# EAGLE design LoraCHIP (EAGLE 7.7.0)
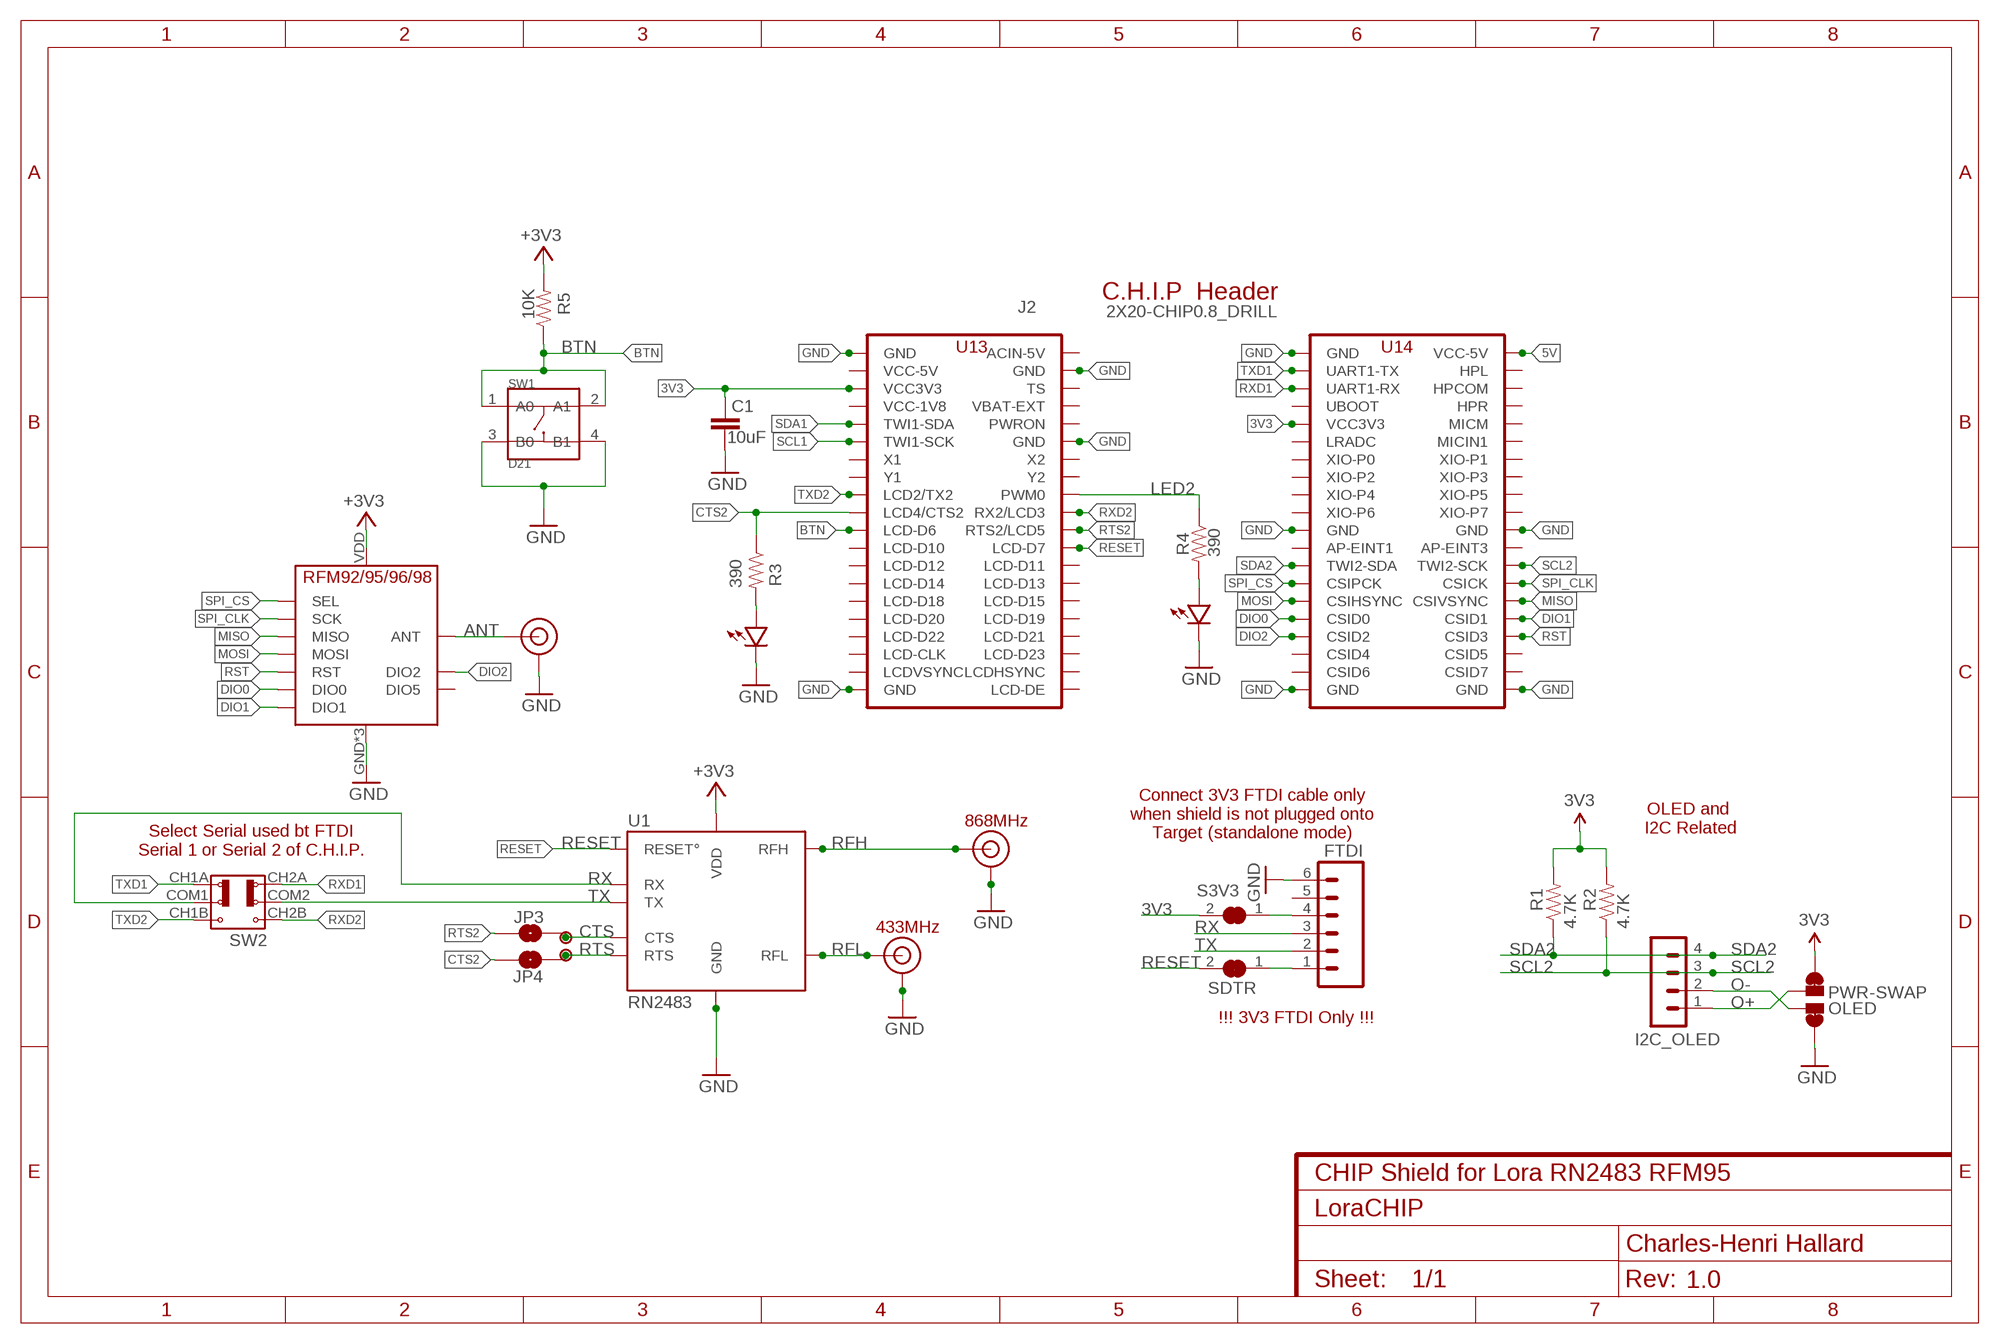
[diagram p0: schematic, sheet 1]
NAME (FRAME-A4L): CNAME: CHIP Shield for Lora RN2483 RFM95; CREVISION: 1.0; DESIGNER: Charles-Henri Hallard

## Parts
C1  10uF  CAP0805-CAP-LARGEPADS  [0805-CAP-LARGEPADS]
FTDI  M06SIP  [1X06]
I2C_OLED  CON_HEADER_1X04'SMALL''  [M1X4]
J2  2X20-CHIP0.8_DRILL  [2X20CHIP_NOOFFSET-TH_0.8]
J$1  ANTENNATINY  [SMA_UFL_PAD_TINY]
J$2  ANTENNATINY  [SMA_UFL_PAD_TINY]
J$3  ANTENNATINY  [SMA_UFL_PAD_TINY]
JP3  CTS  JUMPER-PAD-2-NOYES_SILK  [PAD-JUMPER-2-NO_YES_SILK]
JP4  RTS  JUMPER-PAD-2-NOYES_SILK  [PAD-JUMPER-2-NO_YES_SILK]
OLED  PWR-SWAP  PAD-JUMPER-SWAPSWAP  [PAD-JUMPER-SWAP]
P1  PADSMALL  [PAD-SMALL]
P2  PADSMALL  [PAD-SMALL]
R1  4.7K  RESISTOR0805-RES  [0805-RES]
R2  4.7K  RESISTOR0805-RES  [0805-RES]
R3  390  RESISTOR0805-RES  [0805-RES]
R4  390  RESISTOR0805-RES  [0805-RES]
R5  10K  RESISTOR0805-RES  [0805-RES]
S3V3  SOLDERJUMPER_CLOSED  [SOLDERJUMPER_CLOSEDWIRE]
SDTR  SOLDERJUMPER_CLOSED  [SOLDERJUMPER_CLOSEDWIRE]
SW1  D21  SMD-BUTTON-TOP-DHT-4235A(4P-4.2X3.2MM)  [SW4-SMD-4.2X3.2X2.5MM]
SW2  SWITCH-2CH-6P-3010010P1  [6P-2CH-2.54-9.1X3.5X3.2+2H]
U1  RN2483  RN2483_NOGPIOCTS  [RN2483_NOGPIO]
U$1  GRN  LED0805  [0805-LED]
U$3  RED  LED0805  [0805-LED]
U$4  RFM95  [RFM95]

## Nets
3V3: C1.2 J2.VCC3V3 J2.VCC3V3@1(VCC3V3) OLED.4 OLED.44 R1.2 R2.2 R5.2 S3V3.2 U1.VDD U1.VDD2(VDD) U$4.VDD(VCC) ; supply symbol labelled +3V3
5V: J2.VCC5V@1(VCC-5V)
ANT: J$3.ANT0(ANT) J$3.ANT1(ANT) J$3.ANT2(ANT) U$4.ANT
BTN: J2.LCD-D6 R5.1 SW1.1(A0) SW1.2(A1)
CTS: JP3.1 P1.1 U1.UART_CTS(CTS)
CTS2: J2.LCD-D4(LCD4/CTS2) JP4.2 R3.1
DIO0: J2.CSID0 U$4.DIO0
DIO1: J2.CSID1 U$4.DIO1
DIO2: J2.CSID2 U$4.DIO2
GND: C1.1 FTDI.6 J2.GND@1(GND) J2.GND@2(GND) J2.GND@3(GND) J2.GND@4(GND) J2.GND@5(GND) J2.GND@6(GND) J2.GND@7(GND) J2.GND@8(GND) J2.GND@10(GND) J$1.GND1(GND) J$1.GND2(GND) J$1.GND3(GND) J$1.GND4(GND) J$1.GND5(GND) J$1.GND6(GND) J$2.GND1(GND) J$2.GND2(GND) J$2.GND3(GND) J$2.GND4(GND) J$2.GND5(GND) J$2.GND6(GND) J$3.GND1(GND) J$3.GND2(GND) J$3.GND3(GND) J$3.GND4(GND) J$3.GND5(GND) J$3.GND6(GND) OLED.1 OLED.11 SW1.3(B0) SW1.4(B1) U1.GND U1.GND1(GND) U1.GND2(GND) U1.GND3(GND) U1.GND4(GND) U1.GND5(GND) U1.GND6(GND) U1.GND7(GND) U1.GND8(GND) U1.GND9(GND) U1.GND10(GND) U1.GND11(GND) U1.GND12(GND) U$1.MINUS U$3.MINUS
LD2: R4.2 U$1.PLUS
LED2: J2.PWM0 R4.1
MISO: J2.CSIVSYNC U$4.MISO
MOSI: J2.CSIHSYNC U$4.MOSI
N$1: FTDI.1 SDTR.1
N$2: FTDI.4 S3V3.1
N$3: R3.2 U$3.PLUS
O+: I2C_OLED.1 OLED.3
O-: I2C_OLED.2 OLED.2
RESET: J2.LCD-D7 SDTR.2 U1.RESET°
RFH: J$2.ANT0(ANT) J$2.ANT1(ANT) J$2.ANT2(ANT) U1.RFH
RFL: J$1.ANT0(ANT) J$1.ANT1(ANT) J$1.ANT2(ANT) U1.RFL
RST: J2.CSID3 U$4.RST
RTS: JP4.1 P2.1 U1.UART_RTS(RTS)
RTS2: J2.LCD-D5(RTS2/LCD5) JP3.2
RX: FTDI.3 SW2.COM1 U1.UART_RX(RX)
RXD1: J2.UART1-RX SW2.CH2A
RXD2: J2.LCD-D3(RX2/LCD3) SW2.CH2B
SCL1: J2.TWI1-SCK
SCL2: I2C_OLED.3 J2.TWI2-SCK R2.1
SDA1: J2.TWI1-SDA
SDA2: I2C_OLED.4 J2.TWI2-SDA R1.1
SPI_CLK: J2.CSICK U$4.SCK
SPI_CS: J2.CSIPCK U$4.NSS(SEL)
TX: FTDI.2 SW2.COM2 U1.UART_TX(TX)
TXD1: J2.UART1-TX SW2.CH1A
TXD2: J2.LCD-D2(LCD2/TX2) SW2.CH1B
Unconnected: FTDI.5 J2.AP-EINT1 J2.AP-EINT3 J2.BAT(VBAT-EXT) J2.CHG-IN(ACIN-5V) J2.CSID4 J2.CSID5 J2.CSID6 J2.CSID7 J2.FEL(UBOOT) J2.HPCOM J2.HPL J2.HPR J2.LCD-CLK J2.LCD-D10 J2.LCD-D11 J2.LCD-D12 J2.LCD-D13 J2.LCD-D14 J2.LCD-D15 J2.LCD-D18 J2.LCD-D19 J2.LCD-D20 J2.LCD-D21 J2.LCD-D22 J2.LCD-D23 J2.LCD-DE J2.LCD-HSYNC(LCDHSYNC) J2.LCD-VSYNC(LCDVSYNC) J2.LRADC J2.MICIN1 J2.MICM J2.PWRON J2.TS J2.X1 J2.X2 J2.XIO-P0 J2.XIO-P1 J2.XIO-P2 J2.XIO-P3 J2.XIO-P4 J2.XIO-P5 J2.XIO-P6 J2.XIO-P7 J2.Y1 J2.Y2 U$4.DIO5

## Notes on the sheet
- C.H.I.P  Header
- Connect 3V3 FTDI cable only
  when shield is not plugged onto
  Target (standalone mode)
- OLED and 
  I2C Related
- 868MHz
- Select Serial used bt FTDI
  Serial 1 or Serial 2 of C.H.I.P.
- 433MHz
- !!! 3V3 FTDI Only !!!

## Power pins joined to a net without a drawn wire
GND: U$4.GND U$4.GND1(GND) U$4.GND2(GND)
VCC-1V8: J2.VCC1V8(VCC-1V8)
VCC-5V: J2.VCC5V@0(VCC-5V)

## Library data of the parts
C1 = _c2h:CAP: Capacitor Standard 0603 ceramic capacitor, and 0.1" leaded capacitor.
FTDI = JeeLabs.rpt:M06: Header 6 Standard 6-pin 0.1" header. Use with straight break away headers (SKU : PRT-00116), right angle break away headers (PRT-00553), swiss pins (PRT-00743), machine pins (PRT-00117), and female headers (PRT-00115). Molex polarized connector foot print use with SKU : PRT-08094 with associated crimp pins and housings. NOTES ON THE VARIANTS LOCK and LOCK_LONGPADS... This footprint was designed to help hold the alignment of a through-hole component (i.e. 6-pin header) while soldering it into place. You may notice that each hole has been shifted either up or down by 0.005 of an inch from it's more standard position (which is a perfectly straight line). This slight alteration caused the pins (the squares in the middle) to touch the edges of the holes. Because they are alternating, it causes a "brace" to hold the component in place. 0.005 has proven to be the perfect amount of "off-center" position when using our standard breakaway headers. Although looks a little odd when you look at the bare footprint, once you have a header in there, the alteration is very hard to notice. Also, if you push a header all the way into place, it is covered up entirely on the bottom side. This idea of altering the position of holes to aid alignment will be further integrated into the Sparkfun Library for other footprints. It can help hold any component with 3 or more connection pins.
I2C_OLED = _c2h:CON_HEADER_1X04
J2 = CHIP:2X20-CHIP: Chip header; DESC: 0.8mm drill, no offset
J$1-J$3 = _c2h:ANTENNA: SMA Antenna Connector End launch SMA connector. The paste layer has been removed so that the connector can be hand soldered onto the board after reflow.
JP3 JP4 = SparkFun-Passives:JUMPER-PAD-2-NO
OLED = _c2h:PAD-JUMPER-SWAP
P1 P2 = _c2h-MacBook Pro de Charles-Henri:PAD
R1-R5 = _c2h:RESISTOR: Resistor Basic schematic elements and footprints for 0603, 1206, and PTH resistors.
S3V3 SDTR = microbuilder:SOLDERJUMPER_CLOSED: Solder Jumper - Closed These solder jumpers are closed by default CLOSEDWIRE - 10 mil trace between pads that can be cut and resoldered later CLOSEDPERM - 63 mil trace between pads for a permanent connection (used to 'bridge' two signals, a shameless hack for Eagle). Can double as a test point as well (no cream layer)
SW1 = Switch-2016:SMD-BUTTON-TOP-DHT-4235A(4P-4.2X3.2MM): 311020045; MPN: DHT-4235A; VALUE: DHT-4235A
SW2 = seeed-OPL:SWITCH-2CH-6P*: MS-22D18 G2 ROHS
U1 = _c2h-MacBook Pro de Charles-Henri:RN2483_NOGPIO
U$1 U$3 = _c2h:LED
U$4 = _c2h:RFM95

## Board
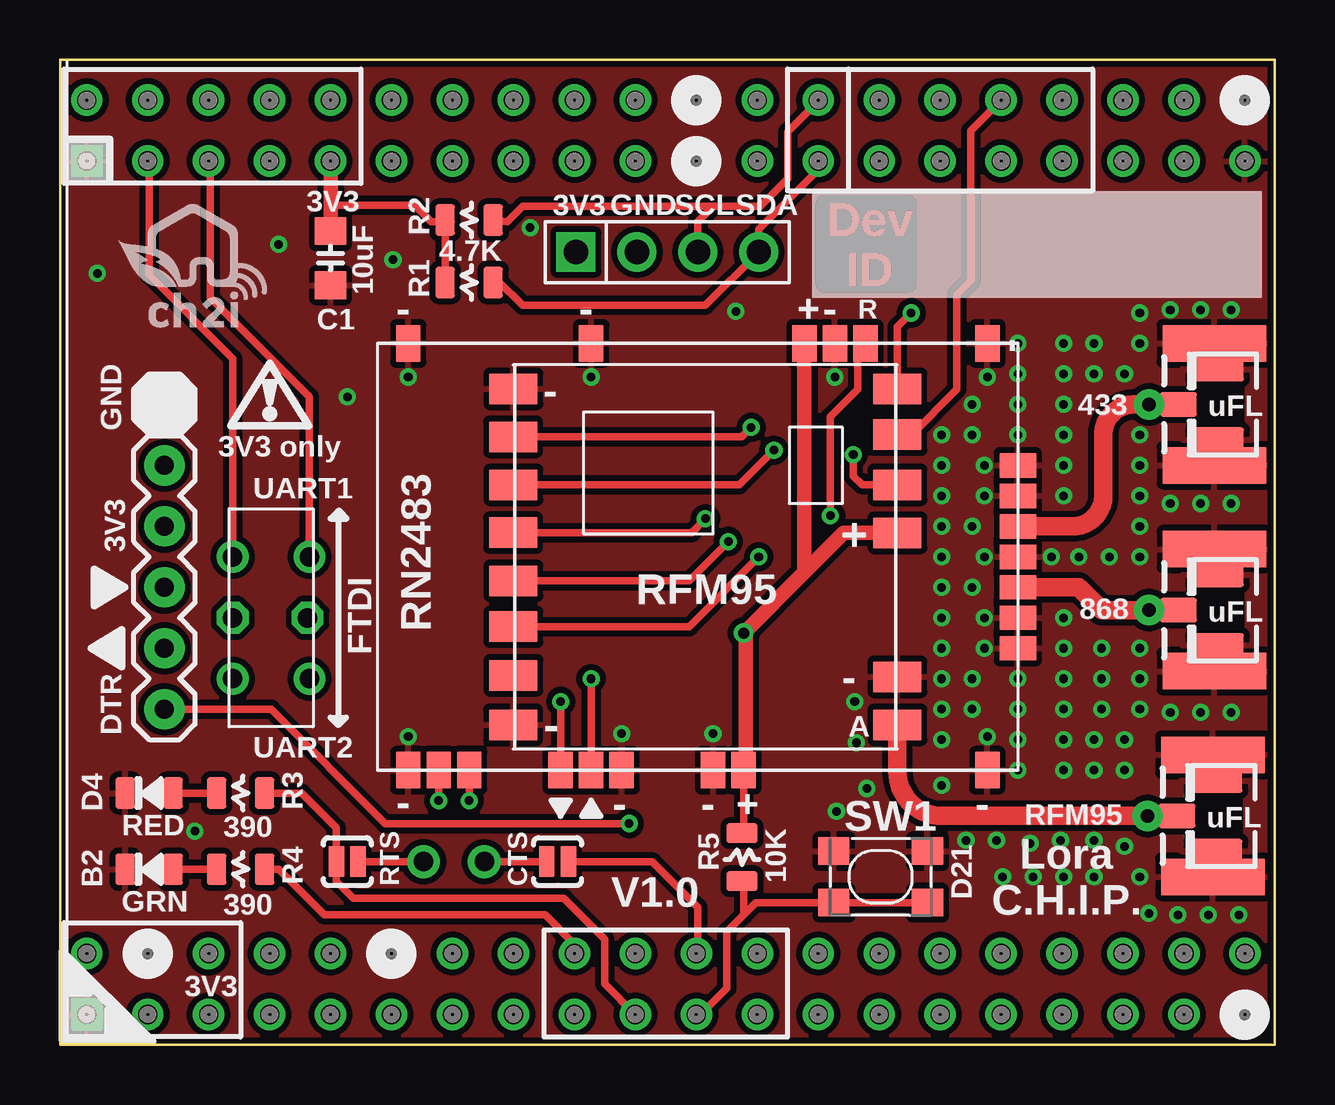
[diagram p1: board, top side]
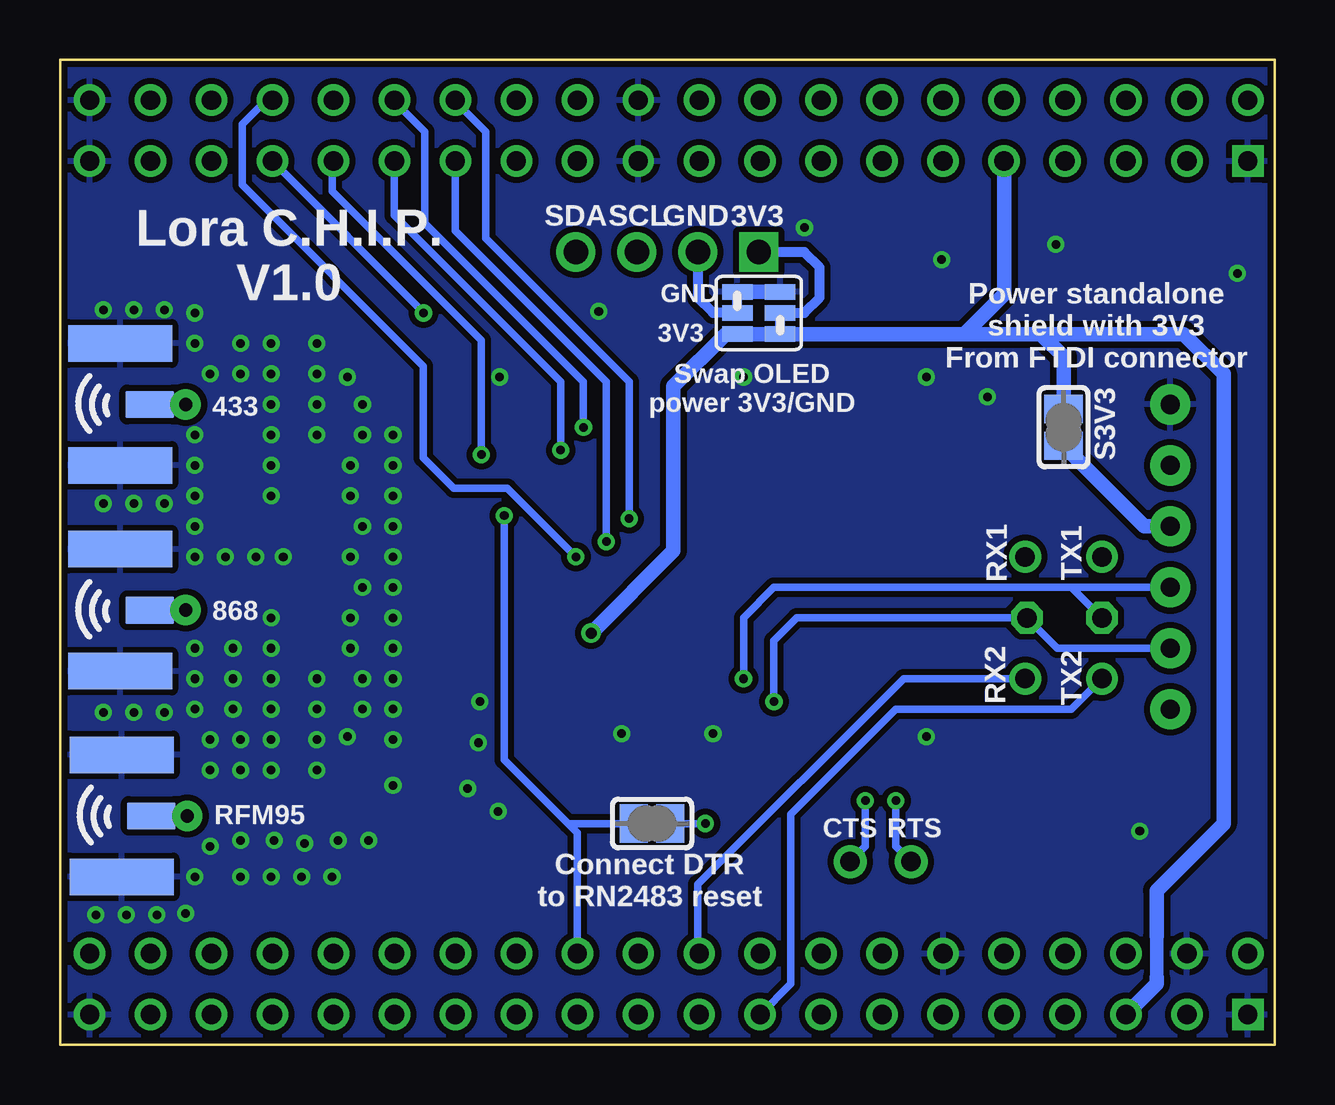
[diagram p2: board, bottom side, seen from below]

Size 50.61 x 41.02 mm. Coordinates in mm from the lower left corner, seen from the top.
Outline: 0,0 50.61,0 50.61,41.02 0,41.02 0,0
Copper layers (1*16): Top 0.035mm / dielectric 1.5mm / Bottom 0.035mm
Design rules "ElectroDragon_2layer_DRU_no_angle_20140221": minimum track width 6mil, minimum drill 12mil, track to track 6mil, track to pad 6mil, pad to pad 6mil, via to via 6mil, smd to smd 6mil, copper to edge 8mil, drill to drill 6mil, minimum pad ring 10mil, minimum via ring 6mil, stop-mask expansion 4mil, vias tented up to drill 100mil, thermal gap 10mil
tRestrict: area 31.8,31.7 to 35.3,35.1

### Footprints (pad centres in the part's own frame; a part is rotated, then mirrored left to right if it is on the bottom)
0805-CAP-LARGEPADS = smd 1.156 x 1.3: 1 -1.127,0; 2 1.127,0
1X06 = drill 0.8 pad 1.676: 1 0,0; 2 2.54,0; 3 5.08,0; 4 7.62,0; 5 10.16,0; 6 12.7,0
M1X4 = drill 1.02 pad 1.632 square: 1 -3.81,0 | drill 1.02 pad 1.632: 2 -1.27,0; 3 1.27,0; 4 3.81,0
2X20CHIP_NOOFFSET-TH_0.8 = drill 0.8: AP-EINT1 15.22,-3.75; AP-EINT3 17.76,-3.75; BAT -17.8,16.57; CHG-IN -17.8,24.19; CSICK 17.76,-8.83; CSID0 15.22,-13.91; CSID1 17.76,-13.91; CSID2 15.22,-16.45; CSID3 17.76,-16.45; CSID4 15.22,-18.99; CSID5 17.76,-18.99; CSID6 15.22,-21.53; CSID7 17.76,-21.53; CSIHSYNC 15.22,-11.37; CSIPCK 15.22,-8.83; CSIVSYNC 17.76,-11.37; FEL 15.22,16.57; GND@1 -17.8,11.49; GND@2 -20.34,-24.07; GND@4 17.76,-1.21; GND@5 17.76,-24.07; GND@6 15.22,-24.07; GND@7 15.22,-1.21; GND@10 -17.8,21.65; HPCOM 17.76,19.11; HPL 17.76,21.65; HPR 17.76,16.57; LCD-CLK -20.34,-18.99; LCD-D2 -20.34,3.87; LCD-D3 -17.8,1.33; LCD-D4 -20.34,1.33; LCD-D5 -17.8,-1.21; LCD-D6 -20.34,-1.21; LCD-D7 -17.8,-3.75; LCD-D10 -20.34,-3.75; LCD-D11 -17.8,-6.29; LCD-D12 -20.34,-6.29; LCD-D13 -17.8,-8.83; LCD-D14 -20.34,-8.83; LCD-D15 -17.8,-11.37; LCD-D18 -20.34,-11.37; LCD-D19 -17.8,-13.91; LCD-D20 -20.34,-13.91; LCD-D21 -17.8,-16.45; LCD-D22 -20.34,-16.45; LCD-D23 -17.8,-18.99; LCD-DE -17.8,-24.07; LCD-HSYNC -17.8,-21.53; LCD-VSYNC -20.34,-21.53; LRADC 15.22,11.49; MICIN1 17.76,11.49; MICM 17.76,14.03; PWM0 -17.8,3.87; PWRON -17.8,14.03; TS -17.8,19.11; TWI1-SCK -20.34,11.49; TWI1-SDA -20.34,14.03; TWI2-SCK 17.76,-6.29; TWI2-SDA 15.22,-6.29; UART1-RX 15.22,19.11; UART1-TX 15.22,21.65; VCC1V8 -20.34,16.57; VCC3V3 -20.34,19.11; VCC3V3@1 15.22,14.03; VCC5V@0 -20.34,21.65; VCC5V@1 17.76,24.19; X1 -20.34,8.95; X2 -17.8,8.95; XIO-P0 15.22,8.95; XIO-P1 17.76,8.95; XIO-P2 15.22,6.41; XIO-P3 17.76,6.41; XIO-P4 15.22,3.87; XIO-P5 17.76,3.87; XIO-P6 15.22,1.33; XIO-P7 17.76,1.33; Y1 -20.34,6.41; Y2 -17.8,6.41 | drill 0.8 square: GND@3 -20.34,24.19; GND@8 15.22,24.19
SMA_UFL_PAD_TINY = smd 2.032 x 1.143 bottom: ANT0 -3.589,0 | smd 1.524 x 1.016: ANT1 -3.843,0 | drill 0.559 pad 1.27: ANT2 -5.08,0 | smd 2.2 x 1.016: GND1 -2.223,1.47; GND2 -2.223,-1.47 | smd 4.318 x 1.524: GND3 -2.349,-2.54; GND4 -2.349,2.54 | smd 4.318 x 1.524 bottom: GND5 -2.349,2.54; GND6 -2.349,-2.54
PAD-JUMPER-2-NO_YES_SILK = smd 0.635 x 1.27: 1 -0.45,0; 2 0.45,0
PAD-JUMPER-SWAP = smd 0.635 x 1.27: 1 -0.876,0.889; 2 0,-0.889; 3 0,0.889; 4 0.876,-0.889; 11 -0.876,-0.889; 44 0.876,0.889
PAD-SMALL = drill 0.813 pad 1.372: 1 0,0
0805-RES = smd 0.8 x 1.3: 1 -1,0; 2 1,0
SOLDERJUMPER_CLOSEDWIRE = smd 1.168 x 1.6: 1 -0.762,0; 2 0.762,0 | smd 0.635 x 0.203: WIRE 0,0
SW4-SMD-4.2X3.2X2.5MM = smd 1.3 x 1.15: 1 -1.95,1.075; 2 1.95,1.075; 3 -1.95,-1.075; 4 1.95,-1.075
6P-2CH-2.54-9.1X3.5X3.2+2H = drill 0.813 pad 1.27: CH1A -2.54,-1.6; CH1B 2.54,-1.6; CH2A -2.54,1.6; CH2B 2.54,1.6 | drill 0.813 pad 1.27 octagon: COM1 0,-1.6; COM2 0,1.524
RN2483_NOGPIO = smd 1.524 x 1.016: GND 17.78,1.27; GND1 17.78,10.16; GND2 17.78,13.97; GND3 17.78,25.4; GND9 0,25.4; GND10 0,19.05; GND11 0,8.89; GND12 0,1.27; RESET° 0,20.32; UART_CTS 17.78,3.81; UART_RTS 17.78,2.54; UART_RX 17.78,8.89; UART_TX 17.78,7.62; VDD 17.78,15.24; VDD2 0,17.78 | smd 1.016 x 1.524: GND4 12.7,26.67; GND5 11.43,26.67; GND6 8.89,26.67; GND7 6.35,26.67; GND8 5.08,26.67; RFH 10.16,26.67; RFL 7.62,26.67
0805-LED = smd 0.8 x 1.3: MINUS -1,0; PLUS 1,0
RFM95 = smd 2 x 1.27: ANT 5.777,-7; DIO0 5.777,3; DIO1 5.779,5.095; DIO2 5.779,7; DIO5 -10.225,-4.936; GND 5.777,-5; GND1 -10.223,7; GND2 -10.23,-7; MISO -10.23,5; MOSI -10.225,3; NSS -10.223,-1; RST -10.223,-2.905; SCK -10.23,1.012; VDD 5.777,1

### Placement (x,y rotation side)
C1  11.27,32.77 90 top
FTDI  4.35,13.97 90 top
I2C_OLED  25.3,33.02 0 top
J2  25.3,21.59 90 top
J$1  50.45,26.67 0 top
J$2  50.45,18.1 0 top
J$3  50.39,9.52 0 top
JP3  20.73,7.62 0 top
JP4  11.97,7.62 180 top
OLED  21.49,30.48 270 bottom
P1  17.68,7.62 0 top
P2  15.14,7.62 0 top
R1  17.05,31.75 180 top
R2  17.05,34.35 180 top
R3  7.52,10.48 180 top
R4  7.52,7.3 180 top
R5  28.42,7.81 90 top
S3V3  8.79,25.72 90 bottom
SDTR  25.94,9.21 180 bottom
SW1  34.19,6.98 180 top
SW2  8.79,17.78 270 top
U1  13.24,29.21 270 top
U$1  3.71,7.3 0 top
U$2  [LOGO_C2I_015]  2.44,29.85 0 top
U$3  3.71,10.48 0 top
U$4  29.11,20.32 0 top

### Tracks (layer width: path | path; a pad name or v marks a point on that pad's centre or on a via)
3V3  (via drill 0.46 pad 0.81)
  Top 0.305: R1.2 R2.2 16.3,34.29 15.46,34.29 14.78,34.98 11.27,34.98 | R5.2 28.48,8.87 U1.VDD 28.58,11.33
  Top 0.61: 31.02,19.68 v28.48,17.14 28.58,17.04 28.58,11.33 | U$4.VDD 32.65,21.32 31.02,19.68 | J2.VCC3V3@1 11.27,34.98 C1.2 | U1.VDD2 31.02,19.68
  Bottom 0.305: OLED.4 OLED.44
  Bottom 0.559: 4.92,4.51 4.92,2.79
  Bottom 0.61: OLED.4 22.88,29.6 25.05,27.43 25.05,20.57 v28.48,17.14 | 4.92,4.51 4.92,6.41 2.13,9.21 2.13,27.94 3.79,29.6 9.75,29.6 | 4.92,2.79 4.92,2.52 J2.VCC3V3 | OLED.44 12.92,29.6 | 12.92,29.6 9.75,29.6 | J2.VCC3V3@1 11.27,31.25 12.92,29.6 | S3V3.2 8.79,28.65 9.75,29.6
ANT
  Top 0.762: U$4.ANT 34.89,11.37 arc90 36.73,9.52 J$3.ANT2 J$3.ANT1
  Bottom 0.762: J$3.ANT0 J$3.ANT2
BTN
  Top 0.305: J2.LCD-D6 26.68,1.25 27.78,2.35 27.78,4.7 28.48,5.4 | 28.48,5.4 28.48,6.75 R5.1 | 28.48,5.4 28.99,5.91 SW1.2 SW1.1
CTS  (via drill 0.36 pad 0.71)
  Top 0.305: P1.1 JP3.1 | U1.UART_CTS v17.05,10.16
  Bottom 0.305: v17.05,10.16 17.05,8.25 P1.1
CTS2
  Top 0.305: J2.LCD-D4 22.7,2.52 22.7,4.38 20.99,6.1 12.22,6.1 11.52,6.8 JP4.2 11.52,9.02 10.06,10.48 R3.1
DIO0  (via drill 0.36 pad 0.71)
  Top 0.305: U$4.DIO0 33.42,23.32 33.05,23.69 v33.05,24.57
  Bottom 0.305: J2.CSID0 39.27,36.75 39.27,35.56 33.05,29.34 v33.05,24.57
DIO1
  Top 0.305: U$4.DIO1 35.48,25.42 37.37,27.31 37.37,31.24 37.94,31.81 37.94,38.08 J2.CSID1
DIO2  (via drill 0.36 pad 0.71)
  Top 0.305: U$4.DIO2 34.89,29.91 v35.46,30.48
  Bottom 0.305: v35.46,30.48 35.46,30.52 J2.CSID2
GND  (via drill 0.36 pad 0.71)
  Bottom 0.305: OLED.11 OLED.1
  other vias: 41.31,20.32 42.45,20.32 41.81,17.78 41.81,16.51 41.81,15.24 41.81,13.97 43.08,12.7 44.35,12.7 41.81,22.86 41.81,24.13 41.81,25.4 41.81,26.67 43.08,27.94 44.35,27.94 41.81,27.94 41.81,12.7 43.72,20.32 44.99,20.32 44.99,21.59 44.99,22.86 44.99,30.48 46.26,30.61 47.53,30.61 38.51,24.13 38.51,22.86 38.51,20.32 38,21.59 38,19.05 38.51,17.78 38.51,16.51 38,15.24 38,25.4 39.91,25.4 39.91,15.24 38,26.67 39.91,26.67 38,13.97 39.91,13.97 39.91,12.7 38.64,12.83 38.64,27.81 39.91,27.94 39.91,29.21 39.91,11.43 41.81,29.21 41.81,11.43 43.08,11.43 43.08,29.21 48.8,30.61 46.26,22.54 47.53,22.54 48.8,22.54 36.73,25.4 36.73,24.13 36.73,22.86 36.73,21.59 36.73,20.32 36.73,19.05 36.73,17.78 36.73,16.51 36.73,15.24 36.73,13.97 44.99,24.13 44.99,29.21 44.35,11.43 44.99,16.51 44.99,15.24 44.99,25.4 32.29,27.81 14.51,27.81 22.13,27.81 27.21,12.95 23.4,12.95 14.51,12.83 28.16,30.54 19.59,34.04 41.69,8.51 43.08,8.51 44.35,8.25 46.26,13.84 47.53,13.84 48.8,13.84 44.99,13.97 44.99,6.98 45.37,5.46 46.58,5.4 47.85,5.4 49.12,5.4 40.42,8.38 39.02,8.51 43.4,16.51 43.4,15.24 43.4,13.97 32.35,9.72 36.73,12.7 37.75,8.51 33.12,14.29 33.18,12.57 33.62,10.67 36.73,10.79 39.27,6.98 40.54,6.98 41.81,6.98 43.08,6.98 1.56,32.13 9.11,33.34 5.62,8.89 11.97,26.99 13.87,32.7
  pour Top (isolate 0.254): -0.1,-0.64 -0.1,41.28 50.7,41.28 50.7,-0.64
  pour Bottom (isolate 0.254): -0.73,41.91 51.34,41.91 51.34,-1.27 -0.73,-1.27
LD2
  Top 0.305: U$1.PLUS R4.2
LED2
  Top 0.305: J2.PWM0 21.43,4.19 20.22,5.4 11.02,5.4 9.11,7.3 R4.1
MISO  (via drill 0.36 pad 0.71)
  Top 0.305: U$4.MISO 28.4,25.32 v28.8,25.72
  Bottom 0.305: J2.CSIVSYNC 36.67,39.31 35.4,38.04 35.4,34.23 28.8,27.62 v28.8,25.72
MOSI  (via drill 0.36 pad 0.71)
  Top 0.305: U$4.MOSI 28.3,23.32 v29.75,24.76
  Bottom 0.305: J2.CSIHSYNC 36.67,34.55 29.75,27.62 v29.75,24.76
N$1  (via drill 0.36 pad 0.71)
  Top 0.305: v23.72,9.21 13.56,9.21 8.79,13.97 FTDI.1
  Bottom 0.305: SDTR.1 v23.72,9.21
N$2
  Bottom 0.61: FTDI.4 5.43,21.59 S3V3.1
N$3
  Top 0.305: U$3.PLUS R3.2
O+
  Bottom 0.406: OLED.3 19.59,30.48 18.95,31.11 18.95,32.39 19.59,33.02 I2C_OLED.1
O-
  Bottom 0.406: OLED.2 23.4,30.48 24.03,31.11 I2C_OLED.2
RESET  (via drill 0.36 pad 0.71)
  Top 0.305: v32.1,22.03 32.1,26.16 33.24,27.31 33.24,28.89 U1.RESET°
  Bottom 0.305: SDTR.2 29.43,9.21 | J2.LCD-D7 29.05,8.83 29.43,9.21 | v32.1,22.03 32.1,11.88 29.43,9.21
RFH
  Top 0.762: U1.RFH 42.45,19.05 43.4,18.1 J$2.ANT2
  Top 0.813: J$2.ANT1 J$2.ANT2
  Bottom 0.813: J$2.ANT0 J$2.ANT2
RFL
  Top 0.762: U1.RFL 42.2,21.59 arc90 43.47,22.86 43.47,25.4 arc-90 44.74,26.67 J$1.ANT2
  Top 0.813: J$1.ANT2 J$1.ANT1
  Bottom 0.813: J$1.ANT0 J$1.ANT2
RST  (via drill 0.36 pad 0.71)
  Top 0.305: U$4.RST 26.21,17.42 v29.11,20.32
  Bottom 0.305: J2.CSID3 42.02,39.35 43.02,38.35 43.02,35.81 35.46,28.26 35.46,24.45 34.19,23.18 31.97,23.18 v29.11,20.32
RTS  (via drill 0.36 pad 0.71)
  Top 0.305: P2.1 JP4.1 | U1.UART_RTS v15.78,10.16
  Bottom 0.305: v15.78,10.16 15.78,8.25 P2.1
RTS2
  Top 0.305: JP3.2 24.67,7.62 26.57,5.71 26.57,3.85 J2.LCD-D5
RX  (via drill 0.36 pad 0.71)
  Top 0.305: U1.UART_RX v22.13,15.24
  Bottom 0.305: v22.13,15.24 22.13,17.78 20.86,19.05 8.46,19.05 | 8.46,19.05 SW2.COM1 | FTDI.3 8.46,19.05
RXD1
  Top 0.305: SW2.CH2A 10.38,20.33 10.38,26.99 6.25,31.11 6.25,36.75 J2.UART1-RX
RXD2
  Bottom 0.305: 24.03,3.81 24.03,3.85 | 24.03,3.85 J2.LCD-D3 | 24.03,3.85 24.03,6.67 15.46,15.24 SW2.CH2B
SCL2
  Top 0.305: J2.TWI2-SCK 31.59,39.31 30.32,38.04 30.32,36.07 29.18,34.92 27.21,34.92 | 27.21,34.92 26.57,34.29 I2C_OLED.3 | R2.1 18.64,34.29 19.27,34.92 27.21,34.92
SDA2
  Top 0.305: R1.1 18.22,31.85 19.27,30.8 26.89,30.8 I2C_OLED.4 29.11,33.97 31.59,36.45 J2.TWI2-SDA
SPI_CLK  (via drill 0.36 pad 0.71)
  Top 0.305: U$4.SCK 26.32,21.33 v26.89,21.91
  Bottom 0.305: J2.CSICK 34.13,39.31 32.86,38.04 32.86,33.59 26.89,27.62 v26.89,21.91
SPI_CS  (via drill 0.36 pad 0.71)
  Top 0.305: U$4.NSS 26.21,19.32 v27.84,20.96
  Bottom 0.305: J2.CSIPCK 34.13,33.91 27.84,27.62 v27.84,20.96
TX  (via drill 0.36 pad 0.71)
  Top 0.305: U1.UART_TX v20.86,14.29
  Bottom 0.305: v20.86,14.29 20.86,16.83 19.91,17.78 SW2.COM2 9.05,16.51 FTDI.2
TXD1
  Top 0.305: SW2.CH1A 7.21,20.33 7.21,28.57 3.71,32.07 3.71,36.75 J2.UART1-TX
TXD2
  Bottom 0.305: J2.LCD-D2 20.16,2.52 20.16,9.59 15.78,13.97 8.46,13.97 SW2.CH1B

### Text on the board
Top: Dev / ID
tNames: 3V3 | 3V3 | GND | SCL | SDA | + | R | - | - | - | - | 433 | GND | 3V3 only | UART1 | 3V3 | FTDI | 868 | DTR | UART2 | D4 | + | - | - | - | - | RFM95 | B2 | Lora / C.H.I.P. | RTS | CTS | V1.0 | 3V3
bNames: GND | SCL | SDA | 3V3 | Lora C.H.I.P. / V1.0 | GND | Power standalone / shield with 3V3 / From FTDI connector | 3V3 | Swap OLED / power 3V3/GND | 433 | TX1 | RX1 | 868 | TX2 | RX2 | RFM95 | RTS | CTS | Connect DTR / to RN2483 reset